# Altium project RFIN DaughterBoard.PrjPcb
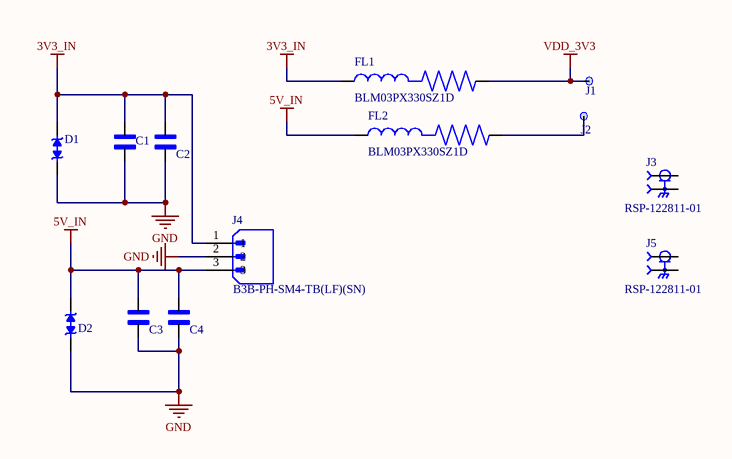
[diagram p0: RFOUT DaughterBoard.SchDoc]
3 sheets, 74 parts. Net scope: flat (ports and power ports of the same name join across sheets).
Board file: RFIN PCB.PcbDoc
Sheets:
  RFOUT DaughterBoard.SchDoc
  FB.SchDoc
  LNA.SchDoc

## Sheet RFOUT DaughterBoard.SchDoc
size A4; SheetNumber: 1; SheetTotal: 3

### Parts
C1  CC0603KRX5R9BB105  [CAPC1608X90]  (value not drawn)
C2  CC0603KRX5R9BB105  [CAPC1608X90]  (value not drawn)
C3  CC0603KRX5R9BB105  [CAPC1608X90]  (value not drawn)
C4  CC0603KRX5R9BB105  [CAPC1608X90]  (value not drawn)
D1  TESDL5V0B12P1Q0_M7G  [DFN61X31X34-2N]  (value not drawn)
D2  TESDL5V0B12P1Q0_M7G  [DFN61X31X34-2N]  (value not drawn)
FL1  BLM03PX330SZ1D  [BEADC0603X33N]
FL2  BLM03PX330SZ1D  [BEADC0603X33N]
J1  Testpoint, Surface, 1.0mm  [TP_1mm_UN1Q]  (value not drawn)  (no BOM)
J2  Testpoint, Surface, 1.0mm  [TP_1mm_UN1Q]  (value not drawn)  (no BOM)
J3  RSP-122811-01  [SAMTEC_RSP-122811-01]
J4  B3B-PH-SM4-TB(LF)(SN)  [JST_B3B-PH-SM4-TB(LF)(SN)]
J5  RSP-122811-01  [SAMTEC_RSP-122811-01]

### Nets
3V3_IN: C1.1 C2.1 D1.2 FL1.1 J4.1
5V_IN: C3.1 C4.1 D2.2 FL2.1 J4.3
GND: C1.2 C2.2 C3.2 C4.2 D1.1 D2.1 J4.2
VDD_3V3: FL1.2 J1.1(TP)
NetFL2_2: FL2.2 J2.1(TP)
NetJ3_G1: J3.G1(GND) J3.G2(GND)
NetJ5_G1: J5.G1(GND) J5.G2(GND)

Not connected (* = marked no-connect by the designer): J3 1; J5 1

### Library data of the parts
C1-C4 = CC0603KRX5R9BB105: 1 ÂµF Â±10% 50V Ceramic Capacitor X5R 0603 (1608 Metric); MF: Yageo; SnapEDA_Link: https://www.snapeda.com/parts/CC0603KRX5R9BB105/Yageo/view-part/?ref=snap; Package: 0603 Yageo; Value: *; MP: CC0603KRX5R9BB105; Check_prices: https://www.snapeda.com/parts/CC0603KRX5R9BB105/Yageo/view-part/?ref=eda
D1 D2 = TESDL5V0B12P1Q0_M7G: MF: {'manufacturer': u'Taiwan Semiconductor'}; Package: None; Price: None; Value: *; MP: TESDL5V0B12P1Q0_M7G; Availability: Unavailable
FL1 FL2 = BLM03PX330SZ1D: 33 Ohms @ 100 MHz 1 Power Line Ferrite Bead 0201 (0603 Metric) 1.5A 55mOhm; MF: Murata; SnapEDA_Link: https://www.snapeda.com/parts/BLM03PX330SZ1D/Murata/view-part/?ref=snap; Package: 0603 Murata; Value: *; MP: BLM03PX330SZ1D; Check_prices: https://www.snapeda.com/parts/BLM03PX330SZ1D/Murata/view-part/?ref=eda
J1 J2 = CMP-001-000153-12: Testpoint 1.0mm; Part Number: TP 1mm; Sort order: -; HasBeenBuilt: -; ClassName: SMALL; ComponentLink1Description: 1_Datasheet; ComponentLink2Description: 2_Product page; ComponentLink3Description: 3_X-information; ComponentLink4Description: 4_X-information; Creation date: 20200101; System: Test Point; Design Item ID: TP_1mm; Source: Conn_UN1Q.SchLib; Component Type: Test Point
J3 J5 = RSP-122811-01: MF: {'manufacturer': u'Samtec Inc.'}; Package: None; Price: None; Value: *; MP: RSP-122811-01; Availability: Unavailable
J4 = B3B-PH-SM4-TB(LF)(SN): Connector Header Surface Mount 3 position 0.079 (2.00mm); MF: JST Sales; Package: NON STANDARD-3 JST; Price: None; Value: *; SnapEDA_Link: https://www.snapeda.com/parts/B3B-PH-SM4-TB(LF)(SN)/JST+Sales+America+Inc./view-part/?ref=snap; MP: B3B-PH-SM4-TB(LF)(SN); Availability: In Stock; Check_prices: https://www.snapeda.com/parts/B3B-PH-SM4-TB(LF)(SN)/JST+Sales+America+Inc./view-part/?ref=eda

## Sheet FB.SchDoc
size A4; SheetNumber: 2; SheetTotal: 3
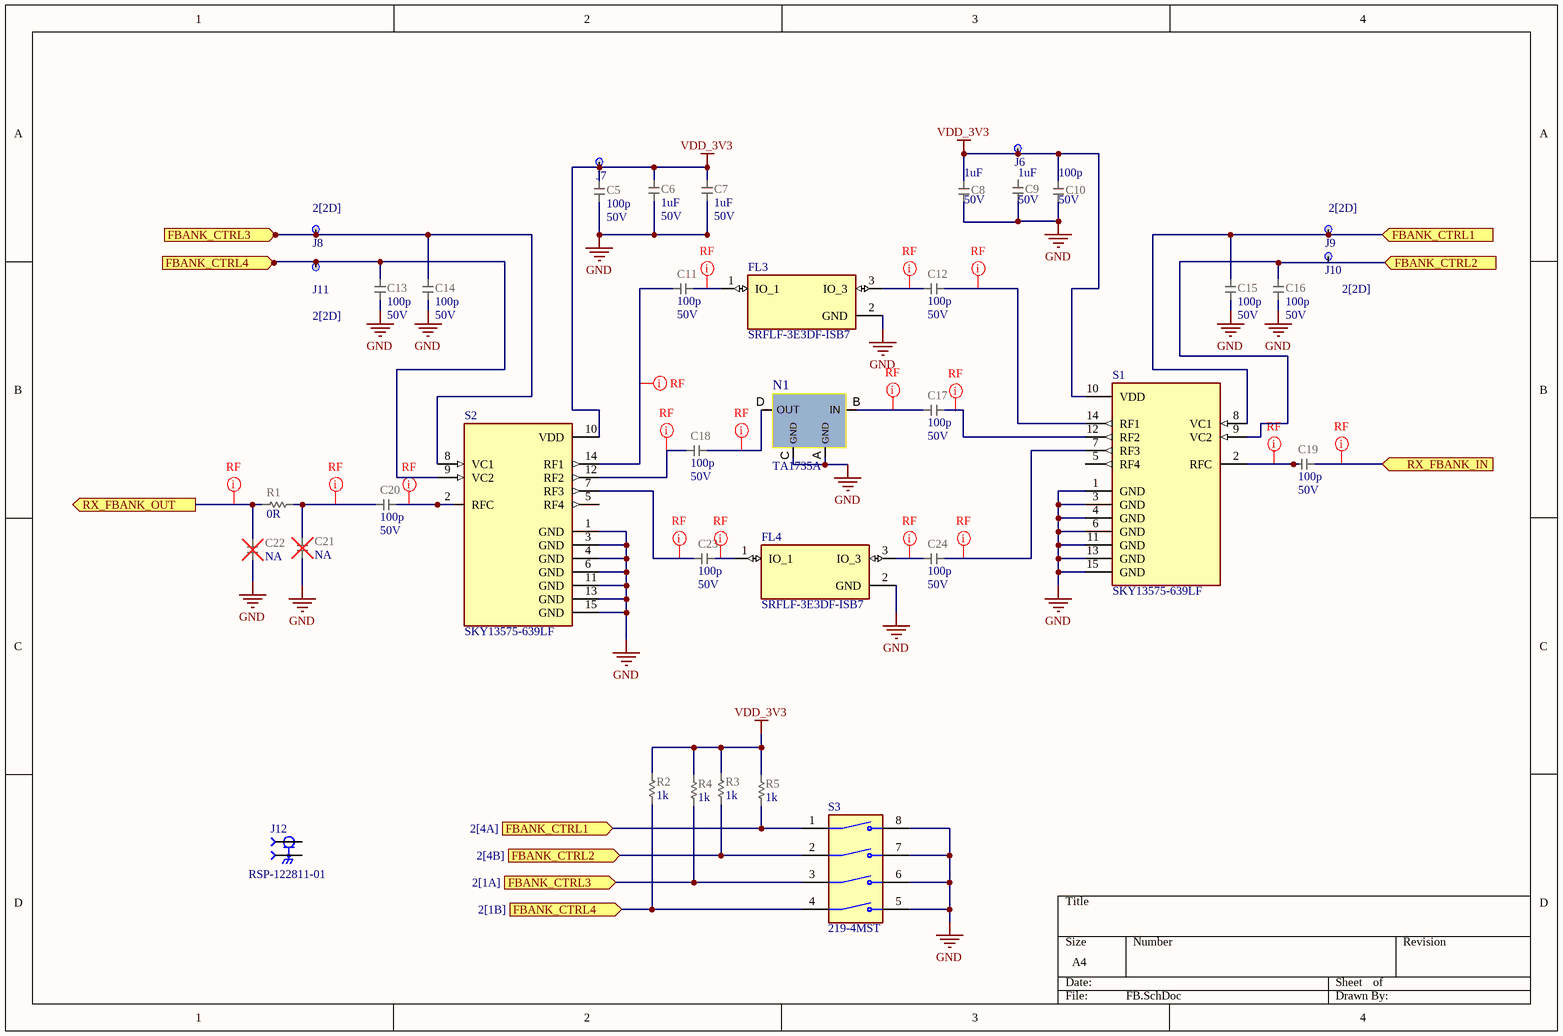
[diagram p1: FB.SchDoc]

### Parts
C5  value 100p  Voltage: 50V  [CAP_0603_UN1Q]  (hidden comment: CAP_0603_100p)
C6  value 1uF  Voltage: 50V  [CAP_0603_UN1Q]  (hidden comment: CAP_0603_1u_X7R)
C7  value 1uF  Voltage: 50V  [CAP_0603_UN1Q]  (hidden comment: CAP_0603_1u_X7R)
C8  value 1uF  Voltage: 50V  [CAP_0603_UN1Q]  (hidden comment: CAP_0603_1u_X7R)
C9  value 1uF  Voltage: 50V  [CAP_0603_UN1Q]  (hidden comment: CAP_0603_1u_X7R)
C10  value 100p  Voltage: 50V  [CAP_0603_UN1Q]  (hidden comment: CAP_0603_100p)
C11  value 100p  Voltage: 50V  [CAP_0603_UN1Q]  (hidden comment: CAP_0603_100p)
C12  value 100p  Voltage: 50V  [CAP_0603_UN1Q]  (hidden comment: CAP_0603_100p)
C13  value 100p  Voltage: 50V  [CAP_0603_UN1Q]  (hidden comment: CAP_0603_100p)
C14  value 100p  Voltage: 50V  [CAP_0603_UN1Q]  (hidden comment: CAP_0603_100p)
C15  value 100p  Voltage: 50V  [CAP_0603_UN1Q]  (hidden comment: CAP_0603_100p)
C16  value 100p  Voltage: 50V  [CAP_0603_UN1Q]  (hidden comment: CAP_0603_100p)
C17  value 100p  Voltage: 50V  [CAP_0603_UN1Q]  (hidden comment: CAP_0603_100p)
C18  value 100p  Voltage: 50V  [CAP_0603_UN1Q]  (hidden comment: CAP_0603_100p)
C19  value 100p  Voltage: 50V  [CAP_0603_UN1Q]  (hidden comment: CAP_0603_100p)
C20  value 100p  Voltage: 50V  [CAP_0603_UN1Q]  (hidden comment: CAP_0603_100p)
C21  value NA  [CAP_0603_UN1Q]  (hidden comment: CAP_0603_NA)
C22  value NA  [CAP_0603_UN1Q]  (hidden comment: CAP_0603_NA)
C23  value 100p  Voltage: 50V  [CAP_0603_UN1Q]  (hidden comment: CAP_0603_100p)
C24  value 100p  Voltage: 50V  [CAP_0603_UN1Q]  (hidden comment: CAP_0603_100p)
FL3  SRFLF-3E3DF-ISB7  [FIL_SRFLF-3E3DF-ISB7]
FL4  SRFLF-3E3DF-ISB7  [FIL_SRFLF-3E3DF-ISB7]
J6  Testpoint, Surface, 1.0mm  [TP_1mm_UN1Q]  (value not drawn)  (no BOM)
J7  Testpoint, Surface, 1.0mm  [TP_1mm_UN1Q]  (value not drawn)  (no BOM)
J8  Testpoint, Surface, 1.0mm  [TP_1mm_UN1Q]  (value not drawn)  (no BOM)
J9  Testpoint, Surface, 1.0mm  [TP_1mm_UN1Q]  (value not drawn)  (no BOM)
J10  Testpoint, Surface, 1.0mm  [TP_1mm_UN1Q]  (value not drawn)  (no BOM)
J11  Testpoint, Surface, 1.0mm  [TP_1mm_UN1Q]  (value not drawn)  (no BOM)
J12  RSP-122811-01  [SAMTEC_RSP-122811-01]
N1  TA1735A  [TA1735A_SM2016-4]
R1  value 0R  [RES_0603_UN1Q]  (hidden comment: RES_0603_0R)
R2  value 1k  [RES_0603_UN1Q]  (hidden comment: RES_0603_1k)
R3  value 1k  [RES_0603_UN1Q]  (hidden comment: RES_0603_1k)
R4  value 1k  [RES_0603_UN1Q]  (hidden comment: RES_0603_1k)
R5  value 1k  [RES_0603_UN1Q]  (hidden comment: RES_0603_1k)
S1  SKY13575-639LF  [SW_SKY13575-639LF]
S2  SKY13575-639LF  [SW_SKY13575-639LF]
S3  219-4MST  [SW_219-4MST]

### Ports
FBANK_CTRL1 (in, see 2[2D]), FBANK_CTRL1 (in, see 2[4A]), FBANK_CTRL2 (in, see 2[2D]), FBANK_CTRL2 (in, see 2[4B]), FBANK_CTRL3 (in, see 2[1A]), FBANK_CTRL3 (in, see 2[2D]), FBANK_CTRL4 (in, see 2[1B]), FBANK_CTRL4 (in, see 2[2D]), RX_FBANK_IN (in), RX_FBANK_OUT (out)

### Nets
GND: C5.2 C6.1 C7.1 C8.1 C9.1 C10.2 C13.2 C14.2 C15.2 C16.2 C21.1 C22.1 FL3.2(GND) FL4.2(GND) N1.A(GND) N1.C(GND) S1.1(GND) S1.3(GND) S1.4(GND) S1.6(GND) S1.11(GND) S1.13(GND) S1.15(GND) S2.1(GND) S2.3(GND) S2.4(GND) S2.6(GND) S2.11(GND) S2.13(GND) S2.15(GND) S3.5 S3.6 S3.7 S3.8
VDD_3V3: C5.1 C6.2 C7.2 C8.2 C10.1 J6.1(TP) J7.1(TP) R2.2 R3.2 R4.2 R5.2 S1.10(VDD) S2.10(VDD)
NetC11_1: C11.1 FL3.1(IO_1)
NetC11_2: C11.2 S2.14(RF1)
NetC12_1: C12.1 S1.14(RF1)
NetC12_2: C12.2 FL3.3(IO_3)
NetC13_1: C13.1 J11.1(TP) R2.1 S2.9(VC2) S3.4 ; port FBANK_CTRL4
NetC14_1: C14.1 J8.1(TP) R4.1 S2.8(VC1) S3.3 ; port FBANK_CTRL3
NetC15_1: C15.1 J9.1(TP) R5.1 S1.8(VC1) S3.1 ; port FBANK_CTRL1
NetC16_1: C16.1 R3.1 S1.9(VC2) S3.2 ; port FBANK_CTRL2
NetC17_1: C17.1 S1.12(RF2)
NetC17_2: C17.2 N1.B(IN)
NetC18_1: C18.1 N1.D(OUT)
NetC18_2: C18.2 S2.12(RF2)
NetC19_1: C19.1 ; port RX_FBANK_IN
NetC19_2: C19.2 S1.2(RFC)
NetC20_1: C20.1 S2.2(RFC)
NetC20_2: C20.2 C21.2 R1.2
NetC22_2: C22.2 R1.1 ; port RX_FBANK_OUT
NetC23_1: C23.1 FL4.1(IO_1)
NetC23_2: C23.2 S2.7(RF3)
NetC24_1: C24.1 S1.7(RF3)
NetC24_2: C24.2 FL4.3(IO_3)
NetJ12_G1: J12.G1(GND) J12.G2(GND)

Not connected (* = marked no-connect by the designer): C9 2; J10 1(TP); J12 1; S1 5(RF4); S2 5(RF4)

### Layout directives
net class RF: (no net found under the mark), NetC11_1, NetC11_2, NetC12_1, NetC12_2, NetC17_2, NetC18_1, NetC18_2, NetC19_1, NetC19_2, NetC20_1, NetC20_2, NetC22_2, NetC23_1, NetC23_2, NetC24_1, NetC24_2

### Library data of the parts
C5 C10-C20 C23 C24 = CMP-001-000378-11: CAP; Manufacturer: Murata; Part Number: GCM188R71H102KA37J; Temperature characteristics: X7R; HasBeenBuilt: TBD; System: RLC; Alternative component: Allowed; Sort order: 306; Tolerance: +/-10%; Creation date: 20210927; Package: 0603; ComponentLink4Description: 4_X-information; ComponentLink2Description: 2_Product page; ECCN: EAR99; RoHS: RoHS3; Operating temperature range: -55 ... +125°C; ComponentLink3Description: 3_X-information; Source: RLC_UN1Q.SchLib; ComponentLink1Description: 1_Datasheet; Manufacturer Part Number: GCM188R71H102KA37J; Component Type: Capacitor
C6-C9 = CMP-001-000333-14: CAP; Part Number: UMK107AB7105KA-T; Manufacturer: Taiyo Yuden; Tolerance: +/-20%; Sort order: 306; HasBeenBuilt: TBD; Alternative component: Allowed; Temperature characteristics: X7R; System: RLC; Package: 0603; ComponentLink1Description: 1_Datasheet; ComponentLink2Description: 2_Product page; ComponentLink3Description: 3_X-information; ComponentLink4Description: 4_X-information; Creation date: 20210917; Source: RLC_UN1Q.SchLib; Manufacturer Part Number: UMK107AB7105KA-T; Component Type: Capacitor
C21 C22 = CMP-001-000259-10: Not Assembled - CAP; Sort order: 999; System: RLC; HasBeenBuilt: TBD; Creation date: 20190101; Package: 0603; Source: RLC_UN1Q.SchLib; ComponentLink3Description: 3_X-information; ComponentLink1Description: 1_Datasheet; ComponentLink2Description: 2_Product page; ComponentLink4Description: 4_X-information; Component Type: Capacitor
FL3 FL4 = SRFLF-3E3DF-ISB7: 3.4mm x 3.3mm SMD ISM 915MHz Low Pass Filter; MF: Suntsu Electronics, Inc; SnapEDA_Link: https://www.snapeda.com/parts/SRFLF-3E3DF-ISB7/Suntsu/view-part/?ref=snap; Package: None; Value: *; MP: SRFLF-3E3DF-ISB7; Check_prices: https://www.snapeda.com/parts/SRFLF-3E3DF-ISB7/Suntsu/view-part/?ref=eda
J6-J11 = CMP-001-000153-12: Testpoint 1.0mm; Part Number: TP 1mm; Sort order: -; HasBeenBuilt: -; ClassName: SMALL; ComponentLink1Description: 1_Datasheet; ComponentLink2Description: 2_Product page; ComponentLink3Description: 3_X-information; ComponentLink4Description: 4_X-information; Creation date: 20200101; System: Test Point; Design Item ID: TP_1mm; Source: Conn_UN1Q.SchLib; Component Type: Test Point
J12 = RSP-122811-01: MF: {'manufacturer': u'Samtec Inc.'}; Package: None; Price: None; Value: *; MP: RSP-122811-01; Availability: Unavailable
N1 = CMP-001-001528-1: 867.5 MHz SAW Filter, IL 3.5 dB, 15 MHz BW; Manufacturer: TAI-SAW; Manufacturer: TST - Tamsan; Sort order: 701; System: RF; Part Number: TA1735A; Operating temperature range: -30 to +80 °C; Package: SM2016-4; Dimensions WxLxH: 1.6 x 2 x 0.90 mm; ComponentLink1Description: 1_Datasheet; ComponentLink1URL: https://www.taisaw.com/assets/PDF/TA1735A%20_Rev.1.0_.pdf; Creation date: 20250828; ECCN: EAR99; ComponentLink2Description: 2_Product page; ComponentLink3Description: 3_X-information; ComponentLink4Description: 4_X-information; RoHS: RoHS 3; Manufacturer Part Number: TA1735A; Component Type: RF Discrete
R1 = CMP-001-000441-13: RES; Manufacturer: YAGEO; Part Number: RC0603FR-070RL; Alternative component: Allowed; HasBeenBuilt: TBD; Tolerance: 5%; Sort order: 326; Power Rating: 1/10W; System: RLC; ComponentLink2Description: 2_Product page; Source: RLC_UN1Q.SchLib; ComponentLink3Description: 3_X-information; ComponentLink1Description: 1_Datasheet; Package: 0603; Creation date: 20190101; ComponentLink4Description: 4_X-information; Component Type: Resistor
R2-R5 = CMP-001-000441-13: RES; Manufacturer: YAGEO; Alternative component: Allowed; HasBeenBuilt: TBD; Tolerance: 5%; Sort order: 326; Power Rating: 1/10W; System: RLC; ComponentLink2Description: 2_Product page; Source: RLC_UN1Q.SchLib; ComponentLink3Description: 3_X-information; ComponentLink1Description: 1_Datasheet; Package: 0603; Creation date: 20190101; ComponentLink4Description: 4_X-information; Component Type: Resistor
S1 S2 = SKY13575-639LF: RF Switch IC 802.11a/b/g/n/ac SP4T 6 GHz 50Ohm 14-QFN (1.6x1.6); MF: Skyworks Solutions; SnapEDA_Link: https://www.snapeda.com/parts/SKY13575-639LF/Skyworks+Solution%252C+Inc./view-part/?ref=snap; Package: QFN-14 Skyworks Solutions; Value: *; MP: SKY13575-639LF; Check_prices: https://www.snapeda.com/parts/SKY13575-639LF/Skyworks+Solution%252C+Inc./view-part/?ref=eda
S3 = 219-4MST: Dip Switch SPST 4 Position Surface Mount Slide (Standard) Actuator 100mA 20VDC; MF: CTS Electronic Components; SnapEDA_Link: https://www.snapeda.com/parts/219-4MST/CTS+Components/view-part/?ref=snap; Package: None; Value: *; MP: 219-4MST; Check_prices: https://www.snapeda.com/parts/219-4MST/CTS+Components/view-part/?ref=eda

## Sheet LNA.SchDoc
size A4; SheetNumber: 3; SheetTotal: 3
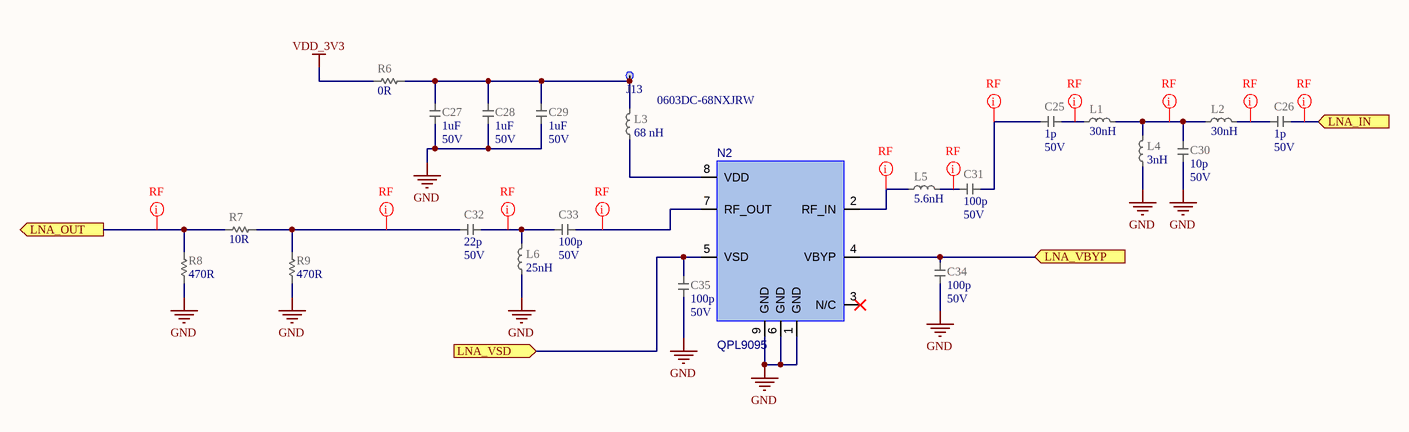
[diagram p2: LNA.SchDoc]

### Parts
C25  value 1p  Voltage: 50V  [CAP_0603_UN1Q]  (hidden comment: CAP_0603_1p)
C26  value 1p  Voltage: 50V  [CAP_0603_UN1Q]  (hidden comment: CAP_0603_1p)
C27  value 1uF  Voltage: 50V  [CAP_0603_UN1Q]  (hidden comment: CAP_0603_1u_X7R)
C28  value 1uF  Voltage: 50V  [CAP_0603_UN1Q]  (hidden comment: CAP_0603_1u_X7R)
C29  value 1uF  Voltage: 50V  [CAP_0603_UN1Q]  (hidden comment: CAP_0603_1u_X7R)
C30  value 10p  Voltage: 50V  [CAP_0603_UN1Q]  (hidden comment: CAP_0603_10p)
C31  value 100p  Voltage: 50V  [CAP_0603_UN1Q]  (hidden comment: CAP_0603_100p)
C32  value 22p  Voltage: 50V  [CAP_0603_UN1Q]  (hidden comment: CAP_0603_22p)
C33  value 100p  Voltage: 50V  [CAP_0603_UN1Q]  (hidden comment: CAP_0603_100p)
C34  value 100p  Voltage: 50V  [CAP_0603_UN1Q]  (hidden comment: CAP_0603_100p)
C35  value 100p  Voltage: 50V  [CAP_0603_UN1Q]  (hidden comment: CAP_0603_100p)
J13  Testpoint, Surface, 1.0mm  [TP_1mm_UN1Q]  (value not drawn)  (no BOM)
L1  value 30nH  [IND_0603_UN1Q]  (hidden comment: IND_0603_30n)
L2  value 30nH  [IND_0603_UN1Q]  (hidden comment: IND_0603_30n)
L3  value 68 nH  Part Number: 0603DC-68NXJRW  [IND_0603_Coilcraft_0603DC]  (hidden comment: IND_0603_68nH_Coilcraft_DC)
L4  value 3nH  [IND_0603_UN1Q]  (hidden comment: IND_0603_3n)
L5  value 5.6nH  [IND_0603_UN1Q]  (hidden comment: IND_0603_5_6n)
L6  value 25nH  [IND_0603_UN1Q]  (hidden comment: IND_0603_25n)
N2  QPL9095  [DFN8_P50_200x200x95_QORVO]
R6  value 0R  [RES_0805_UN1Q]  (hidden comment: RES_0805_0R0)
R7  value 10R  [RES_0603_UN1Q]  (hidden comment: RES_0603_10R)
R8  value 470R  [RES_0603_UN1Q]  (hidden comment: RES_0603_470R)
R9  value 470R  [RES_0603_UN1Q]  (hidden comment: RES_0603_470R)

### Ports
LNA_IN (in), LNA_OUT (out), LNA_VBYP (in), LNA_VSD (in)

### Nets
GND: C27.1 C28.1 C29.1 C30.1 C34.1 C35.1 L4.1 L6.1 N2.1(GND) N2.6(GND) N2.9(GND) R8.1 R9.1
VDD_3V3: R6.1
NetC25_1: C25.1 L1.1
NetC25_2: C25.2 C31.1
NetC26_1: C26.1 ; port LNA_IN
NetC26_2: C26.2 L2.2
NetC27_2: C27.2 C28.2 C29.2 J13.1(TP) L3.2 R6.2
NetC30_2: C30.2 L1.2 L2.1 L4.2
NetC31_2: C31.2 L5.2
NetC32_1: C32.1 C33.2 L6.2
NetC32_2: C32.2 R7.2 R9.2
NetC33_1: C33.1 N2.7(RF_OUT)
NetC34_2: C34.2 N2.4(VBYP) ; port LNA_VBYP
NetC35_2: C35.2 N2.5(VSD) ; port LNA_VSD
NetL3_1: L3.1 N2.8(VDD)
NetL5_1: L5.1 N2.2(RF_IN)
NetR7_1: R7.1 R8.2 ; port LNA_OUT

Not connected (* = marked no-connect by the designer): N2 3(N/C)*

### Layout directives
net class RF: NetC25_1, NetC25_2, NetC26_1, NetC26_2, NetC30_2, NetC31_2, NetC32_1, NetC32_2, NetC33_1, NetL5_1, NetR7_1

### Library data of the parts
C25 C26 C30-C35 = CMP-001-000378-11: as C5 on sheet FB; Creation date: 20210927; Package: 0603; ComponentLink4Description: 4_X-information; ComponentLink2Description: 2_Product page; ECCN: EAR99; RoHS: RoHS3; Operating temperature range: -55 ... +125°C; ComponentLink3Description: 3_X-information; Source: RLC_UN1Q.SchLib; ComponentLink1Description: 1_Datasheet; Manufacturer Part Number: GCM188R71H102KA37J; Component Type: Capacitor
C27-C29 = CMP-001-000333-14: as C6 on sheet FB; Package: 0603; ComponentLink1Description: 1_Datasheet; ComponentLink2Description: 2_Product page; ComponentLink3Description: 3_X-information; ComponentLink4Description: 4_X-information; Creation date: 20210917; Source: RLC_UN1Q.SchLib; Manufacturer Part Number: UMK107AB7105KA-T; Component Type: Capacitor
J13 = CMP-001-000153-12: Testpoint 1.0mm; Part Number: TP 1mm; Sort order: -; HasBeenBuilt: -; ClassName: SMALL; ComponentLink1Description: 1_Datasheet; ComponentLink2Description: 2_Product page; ComponentLink3Description: 3_X-information; ComponentLink4Description: 4_X-information; Creation date: 20200101; System: Test Point; Design Item ID: TP_1mm; Source: Conn_UN1Q.SchLib; Component Type: Test Point
L1 L2 L4-L6 = CMP-034-000025-11: Manufacturer: TDK; Manufacturer Part Number: MLZ1608M100WTD25; Desc2: inductor_10uH_1R_250mA; Sort order: 346; Tolerance: 10%; HasBeenBuilt: False; Package: 0603; Dimensions WxLxH: 1.6 x 0.8 x 0.8 +-0.15; HasBeenChecked: False; ComponentLink1Description: 1_Datasheet; ComponentLink1URL: https://product.tdk.com/en/search/inductor/inductor/smd/info?part_no=MLZ1608M100WTD25; ComponentLink2Description: 2_Product page; ComponentLink3Description: 3_X-information; ComponentLink4Description: 4_X-information; Creation date: 20230111; Component Type: Inductor
L3 = CMP-001-001491-1: IND High Q Ceramic Chip; System: RLC; Tolerance: 10%; Sort order: 346; Dimensions WxLxH: 1.7 x 0.99 x 0.89; ComponentLink3Description: 3_X-information; Creation date: 20250807; ComponentLink1Description: 1_Datasheet; Package: 0603; ComponentLink1URL: https://www.coilcraft.com/en-us/products/rf/ceramic-core-chip-inductors/0603-(1608)/0603dc/?skuId=30647; Manufacturer: Coilcraft; ComponentLink2Description: 2_Product page; Operating temperature range: -55℃ to 125℃; ComponentLink4Description: 4_X-information; ECCN: EAR99; RoHS: RoHS 3; Manufacturer Part Number: 0603DC-68NXJRW; Component Type: Inductor
N2 = CMP-001-001198-7: Ultra Low-Noise, Bypass LNA; Manufacturer: Qorvo; Manufacturer Part Number: QPL9095SR; Sort order: 721; System: RF; ComponentLink4Description: 4_X-information; ComponentLink2URL: https://www.qorvo.com/products/p/QPL9095; ClassName: BIG; ComponentLink1Description: 1_Datasheet; Operating temperature range: -40°C ... 105°C; Package: DFN50; ComponentLink1URL: https://www.qorvo.com/products/d/da006183; Creation Date: 20240607; ComponentLink3Description: 3_X-information; ComponentLink3URL: https://www.qorvo.com/products/d/da006076; ComponentLink2Description: 2_Product page; Dimensions WxLxH: 2 x 2 x 0.95; Part Number: QPL9095; Component Type: RF IC
R6 = CMP-001-000676-11: RES 0805 0R.; Manufacturer: Susumu; Manufacturer Part Number: KRL1220E-M-R010-F; Tolerance: 1%; Sort order: 328; HasBeenBuilt: False; Power Rating: 1/2W; System: RLC; Package: 0805; Operating temperature range: -55C ... +155C; ComponentLink1Description: 1_Datasheet; ComponentLink1URL: https://www.susumu.co.jp/common/pdf/n_catalog_partition09_en.pdf; ComponentLink2Description: 2_Product page; ComponentLink3Description: 3_X-information; ComponentLink4Description: 4_X-information; Creation date: 20210928; Source: RLC_UN1Q.SchLib; Component Type: Resistor
R7-R9 = CMP-001-000441-13: as R2 on sheet FB; ComponentLink2Description: 2_Product page; Source: RLC_UN1Q.SchLib; ComponentLink3Description: 3_X-information; ComponentLink1Description: 1_Datasheet; Package: 0603; Creation date: 20190101; ComponentLink4Description: 4_X-information; Component Type: Resistor

## Nets that join several sheets
GND: RFOUT DaughterBoard (7 pins), FB (34 pins), LNA (13 pins)
VDD_3V3: RFOUT DaughterBoard (FL1.2 J1.1), FB (13 pins), LNA (R6.1)